# EAGLE design caudalimetro (EAGLE 7.2.0)
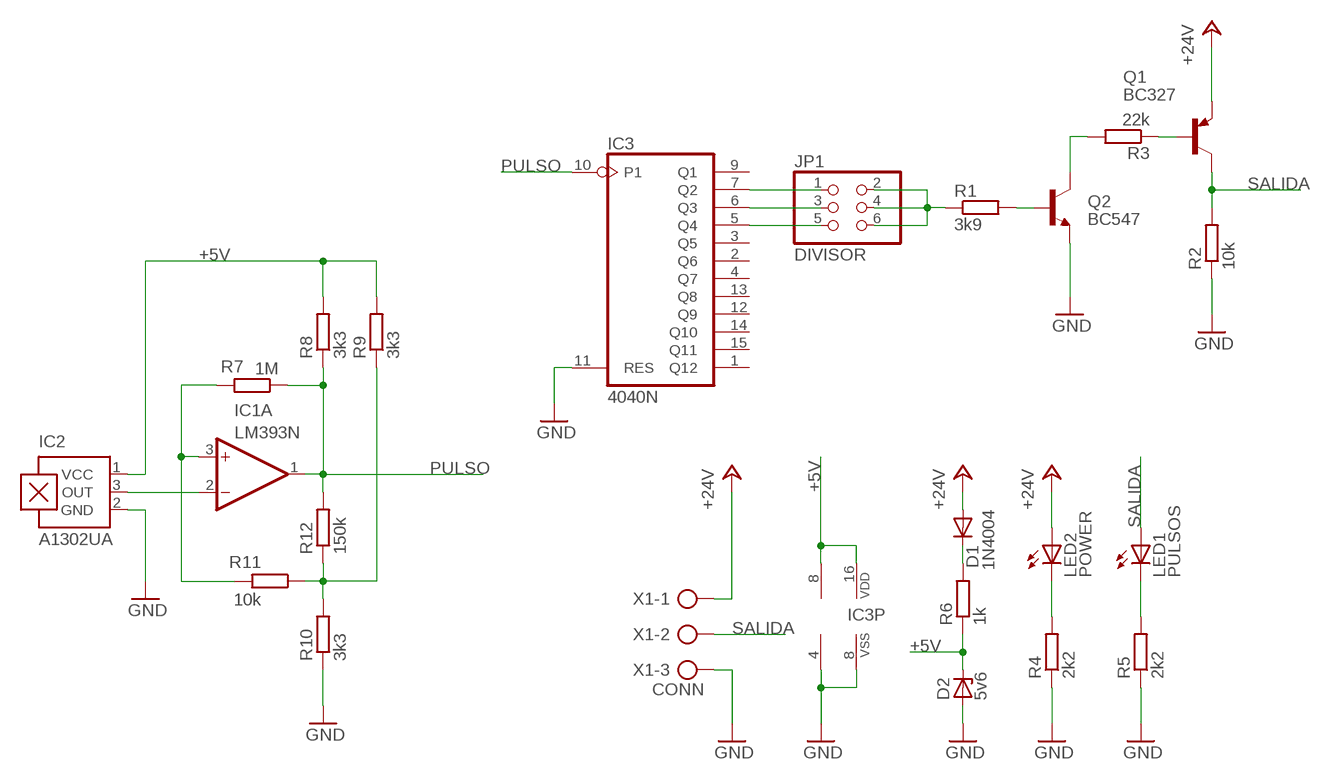
[diagram p0: schematic, sheet 1]

## Parts
D1  1N4004  [DO41-10]
D2  5v6  ZENER-DIODEZD-2.5  [ZDIO-2.5]
IC1  LM393N  [DIL08]
IC2  A1302UA  [SIP3-UA]
IC3  4040N  [DIL16]
JP1  DIVISOR  PINHD-2X3  [2X03]
LED1  PULSOS  LED3MM  [LED3MM]
LED2  POWER  LED3MM  [LED3MM]
Q1  BC327  [TO92]
Q2  BC547  [TO92]
R1  3k9  R-EU_0207/2V  [0207/2V]
R2  10k  R-EU_0207/2V  [0207/2V]
R3  22k  R-EU_0207/2V  [0207/2V]
R4  2k2  R-EU_0207/2V  [0207/2V]
R5  2k2  R-EU_0207/2V  [0207/2V]
R6  1k  R-EU_0207/2V  [0207/2V]
R7  1M  R-EU_0207/2V  [0207/2V]
R8  3k3  R-EU_0207/2V  [0207/2V]
R9  3k3  R-EU_0207/2V  [0207/2V]
R10  3k3  R-EU_0207/2V  [0207/2V]
R11  10k  R-EU_0207/2V  [0207/2V]
R12  150k  R-EU_0207/2V  [0207/2V]
X1  CONN  AK300/3  [AK300/3]

## Nets
+5V: D2.C IC1.8(P:V+) IC2.1(VCC) IC3.16(VDD) R6.1 R8.2 R9.2
+24V: D1.A LED2.A Q1.1(E) X1.1
GND: D2.A IC1.4(P:V-) IC2.2(GND) IC3.8(VSS) IC3.11(RES) Q2.1(E) R2.1 R4.1 R5.1 R10.1 X1.3
N$1: IC3.7(Q2) JP1.1
N$2: IC3.6(Q3) JP1.3
N$3: IC3.5(Q4) JP1.5
N$4: Q2.2(B) R1.2
N$5: Q2.3(C) R3.2
N$6: LED2.K(C) R4.2
N$7: LED1.K(C) R5.2
N$8: IC1.2(A:-IN) IC2.3(OUT)
N$9: D1.C R6.2
N$10: JP1.2 JP1.4 JP1.6 R1.1
N$11: Q1.2(B) R3.1
N$13: R9.1 R10.2 R11.1 R12.1
N$14: IC1.3(A:+IN) R7.2 R11.2
PULSO: IC1.1(A:OUT) IC3.10(P1) R7.1 R8.1 R12.2
SALIDA: LED1.A Q1.3(C) R2.2 X1.2
Unconnected: IC1.5(B:+IN) IC1.6(B:-IN) IC1.7(B:OUT) IC3.1(Q12) IC3.2(Q6) IC3.3(Q5) IC3.4(Q7) IC3.9(Q1) IC3.12(Q9) IC3.13(Q8) IC3.14(Q10) IC3.15(Q11)

## Library data of the parts
D1 = adafruit:1N4004: DIODE General purpose 1N400x type rectifier (With bigger pads) http://www.ladyada.net/library/pcb/eaglelibrary.html
D2 = diode:ZENER-DIODE: Z-Diode
IC1 = linear:LM393: COMPARATOR
IC2 = allegro:A13*?: Linear Hall Effect Sensor ICs Continuous-Time Ratiometric High-Temperature Operation Programmable Linear with Analog Output A1302 -Replacement- UGN3503 Source: http://www.allegromicro.com/en/Products/Part_Numbers/1301/1301.pdf http://www.allegromicro.com/en/Products/Part_Numbers/1321/1321.pdf http://www.allegromicro.com/en/Products/Part_Numbers/1381/1381.pdf; MF: ALLEGRO MICROSYSTEMS, INC.; MPN: A1302EUA-T; OC_FARNELL: 1521708; OC_NEWARK: 31K6639
IC3 = 40xx:4040: 12-stage binary/ripple COUNTER
JP1 = pinhead:PINHD-2X3: PIN HEADER
LED1 LED2 = led:LED: LED OSRAM: - CHIPLED LG R971, LG N971, LY N971, LG Q971, LY Q971, LO R971, LY R971 LH N974, LH R974 LS Q976, LO Q976, LY Q976 LO Q996 - Hyper CHIPLED LW Q18S LB Q993, LB Q99A, LB R99A - SideLED LS A670, LO A670, LY A670, LG A670, LP A670 LB A673, LV A673, LT A673, LW A673 LH A674 LY A675 LS A676, LA A676, LO A676, LY A676, LW A676 LS A679, LY A679, LG A679 - Hyper Micro SIDELED® LS Y876, LA Y876, LO Y876, LY Y876 LT Y87S - SmartLED LW L88C, LW L88S LB L89C, LB L89S, LG L890 LS L89K, LO L89K, LY L89K LS L896, LA L896, LO L896, LY L896 - TOPLED LS T670, LO T670, LY T670, LG T670, LP T670 LSG T670, LSP T670, LSY T670, LOP T670, LYG T670 LG T671, LOG T671, LSG T671 LB T673, LV T673, LT T673, LW T673 LH T674 LS T676, LA T676, LO T676, LY T676, LB T676, LH T676, LSB T676, LW T676 LB T67C, LV T67C, LT T67C, LS T67K, LO T67K, LY T67K, LW E67C LS E67B, LA E67B, LO E67B, LY E67B, LB E67C, LV E67C, LT E67C LW T67C LS T679, LY T679, LG T679 LS T770, LO T770, LY T770, LG T770, LP T770 LB T773, LV T773, LT T773, LW T773 LH T774 LS E675, LA E675, LY E675, LS T675 LS T776, LA T776, LO T776, LY T776, LB T776 LHGB T686 LT T68C, LB T68C - Hyper Mini TOPLED® LB M676 - Mini TOPLED Santana® LG M470 LS M47K, LO M47K, LY M47K Source: http://www.osram.convergy.de LUXEON: - LUMILED® LXK2-PW12-R00, LXK2-PW12-S00, LXK2-PW14-U00, LXK2-PW14-V00 LXK2-PM12-R00, LXK2-PM12-S00, LXK2-PM14-U00 LXK2-PE12-Q00, LXK2-PE12-R00, LXK2-PE12-S00, LXK2-PE14-T00, LXK2-PE14-U00 LXK2-PB12-K00, LXK2-PB12-L00, LXK2-PB12-M00, LXK2-PB14-N00, LXK2-PB14-P00, LXK2-PB14-Q00 LXK2-PR12-L00, LXK2-PR12-M00, LXK2-PR14-Q00, LXK2-PR14-R00 LXK2-PD12-Q00, LXK2-PD12-R00, LXK2-PD12-S00 LXK2-PH12-R00, LXK2-PH12-S00 LXK2-PL12-P00, LXK2-PL12-Q00, LXK2-PL12-R00 Source: www.luxeon.com KINGBRIGHT: KA-3528ASYC Source: www.kingbright.com
Q1 = transistor-pnp:BC327: PNP Transistor
Q2 = transistor:BC547: NPN TRANSISTOR
R1-R12 = rcl:R-EU_: RESISTOR, European symbol
X1 = con-ptr500:AK300/3: CONNECTOR; OC_FARNELL: unknown; OC_NEWARK: unknown

## Board
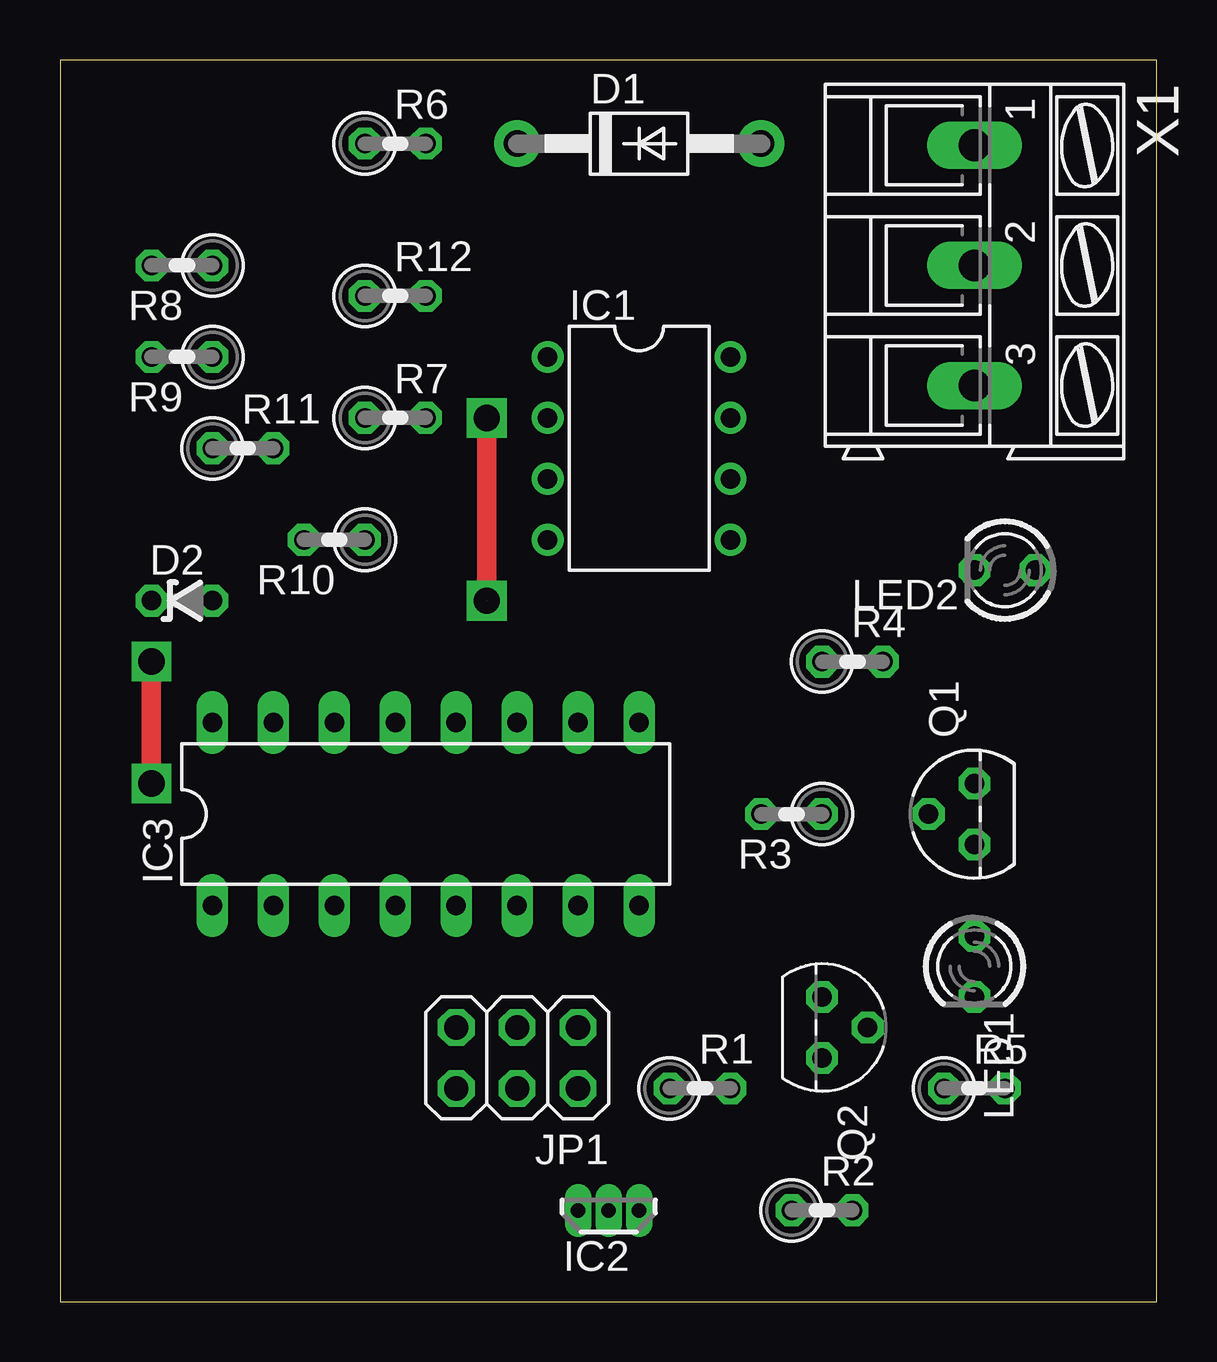
[diagram p1: board, top side]
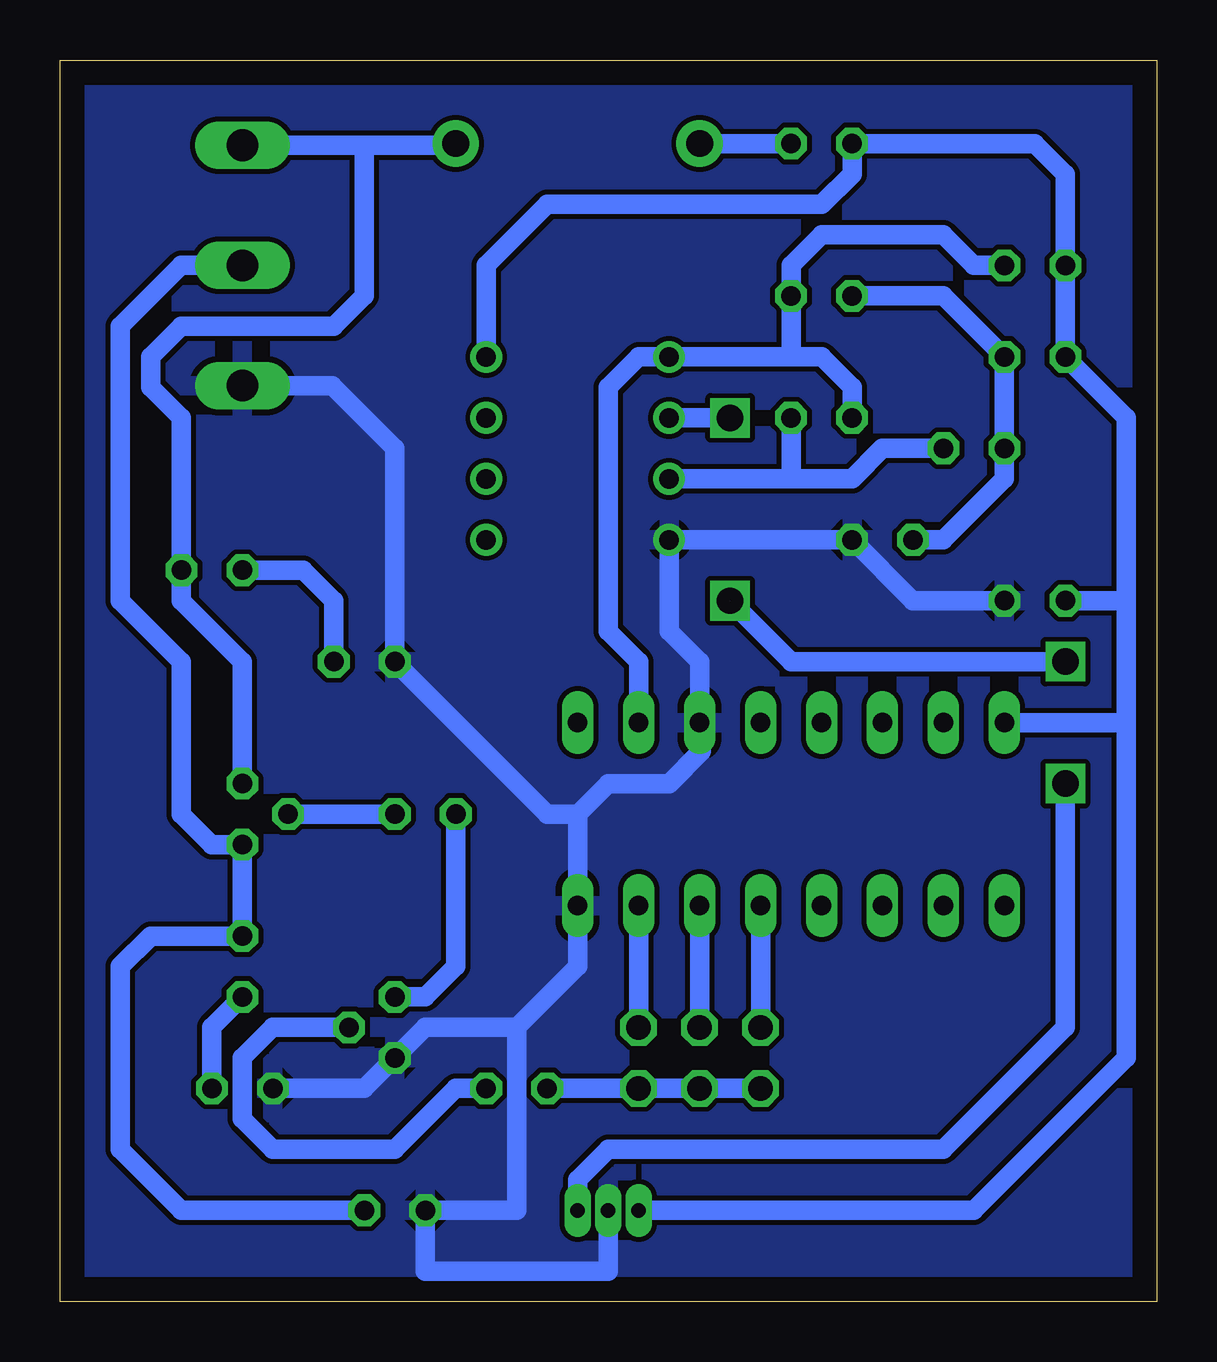
[diagram p2: board, bottom side, seen from below]

Size 45.7 x 51.74 mm. Coordinates in mm from the lower left corner, seen from the top.
Outline: 0,0 45.7,0 45.7,51.74 0,51.74 0,0
Copper layers (1*16): Top 0.035mm / dielectric 1.5mm / Bottom 0.035mm
Design rules "default": minimum track width 10mil, minimum drill 24mil, track to track 8mil, track to pad 8mil, pad to pad 8mil, via to via 8mil, smd to smd 8mil, copper to edge 40mil, drill to drill 8mil, minimum pad ring 10mil, minimum via ring 8mil, stop-mask expansion 4mil, vias tented up to drill 0mil, thermal gap 10mil

### Footprints (pad centres in the part's own frame; a part is rotated, then mirrored left to right if it is on the bottom)
DO41-10 = drill 1.118 pad 1.93: A 5.08,0; C -5.08,0
ZDIO-2.5 = drill 0.813 octagon: A 1.27,0; C -1.27,0
DIL08 = drill 0.813 pad 1.27: 1 -3.81,-3.81; 2 -1.27,-3.81; 3 1.27,-3.81; 4 3.81,-3.81; 5 3.81,3.81; 6 1.27,3.81; 7 -1.27,3.81; 8 -3.81,3.81
SIP3-UA = drill 0.6 pad 0.7 long: 1 -1.27,0; 2 0,0; 3 1.27,0
DIL16 = drill 0.813 long: 1 -8.89,-3.81; 2 -6.35,-3.81; 3 -3.81,-3.81; 4 -1.27,-3.81; 5 1.27,-3.81; 6 3.81,-3.81; 7 6.35,-3.81; 8 8.89,-3.81; 9 8.89,3.81; 10 6.35,3.81; 11 3.81,3.81; 12 1.27,3.81; 13 -1.27,3.81; 14 -3.81,3.81; 15 -6.35,3.81; 16 -8.89,3.81
2X03 = drill 1.016 octagon: 1 -2.54,-1.27; 2 -2.54,1.27; 3 0,-1.27; 4 0,1.27; 5 2.54,-1.27; 6 2.54,1.27
LED3MM = drill 0.813 octagon: A -1.27,0; K 1.27,0
TO92 = drill 0.813 octagon: 1 1.27,0; 2 0,1.905; 3 -1.27,0
0207/2V = drill 0.813 octagon: 1 -1.27,0; 2 1.27,0
AK300/3 = drill 1.321 long: 1 -5.004,0; 2 0,0; 3 5.004,0

### Placement (x,y rotation side)
D1  24.13,48.26 0 top
D2  5.08,29.21 0 top
IC1  24.13,35.56 270 top
IC2  22.86,3.81 0 top
IC3  15.24,20.32 0 top
JP1  19.05,10.16 180 top
LED1  38.1,13.97 270 top
LED2  39.37,30.48 180 top
Q1  38.1,20.32 90 top
Q2  31.75,11.43 270 top
R1  26.67,8.89 0 top
R2  31.75,3.81 0 top
R3  30.48,20.32 180 top
R4  33.02,26.67 0 top
R5  38.1,8.89 0 top
R6  13.97,48.26 0 top
R7  13.97,36.83 0 top
R8  5.08,43.18 180 top
R9  5.08,39.37 180 top
R10  11.43,31.75 180 top
R11  7.62,35.56 0 top
R12  13.97,41.91 0 top
X1  38.1,43.18 270 top

### Tracks (layer width: path | path; a pad name or v marks a point on that pad's centre or on a via)
+5V
  Bottom 0.813: IC1.8 27.94,43.18 25.4,45.72 13.97,45.72 12.7,46.99 R6.1 5.08,48.26 3.81,46.99 R8.2 R9.2 1.27,36.83 1.27,29.21 | 1.27,24.13 1.27,10.16 7.62,3.81 IC2.1 | 1.27,24.13 1.27,29.21 | D2.C 1.27,29.21 | IC3.16 1.27,24.13
+24V
  Bottom 0.813: X1.1 33.02,48.18 | 33.02,48.18 29.29,48.18 D1.A | Q1.1 38.1,26.67 40.64,29.21 LED2.A 40.64,36.83 41.91,38.1 41.91,39.37 40.64,40.64 34.29,40.64 33.02,41.91 33.02,48.18
GND
  Bottom 0.254: 24,16.66 IC3.8 | 18.97,23.98 IC3.11
  Bottom 0.813: X1.3 34.37,38.18 31.75,35.56 R4.1 25.4,20.32 24.13,20.32 | 18.97,23.98 18.97,22.94 20.32,21.59 22.86,21.59 24.13,20.32 | 24.13,20.32 IC3.8 24.13,13.97 26.67,11.43 | 26.67,11.43 30.48,11.43 Q2.1 33.02,8.89 R5.1 | D2.A 10.16,29.21 R10.1 IC1.4 20.32,27.94 19.05,26.67 IC3.11 | IC2.2 22.86,1.27 30.48,1.27 R2.1 26.67,3.81 26.67,11.43
  pour Bottom: 0,52.07 45.72,52.07 45.72,0 0,0
N$1
  Bottom 0.813: JP1.1 IC3.7
N$2
  Bottom 0.813: JP1.3 IC3.6
N$3
  Bottom 0.813: JP1.5 IC3.5
N$4
  Bottom 0.813: R1.2 29.21,8.89 31.75,6.35 36.83,6.35 38.1,7.62 38.1,10.16 36.83,11.43 Q2.2
N$5
  Bottom 0.813: Q2.3 30.48,12.7 29.21,13.97 R3.2
N$6
  Bottom 0.813: LED2.K 35.56,30.48 34.29,29.21 R4.2
N$7
  Bottom 0.813: LED1.K 39.37,11.43 R5.2
N$8  (via drill 1.1)  (1 unrouted)
  Top 0.813: v17.78,36.83 17.78,29.21 | v3.81,21.59 v3.81,26.67
  Bottom 0.813: IC1.2 v17.78,36.83 | v3.81,21.59 3.81,11.43 8.89,6.35 22.86,6.35 24.13,5.08 IC2.3 | v3.81,26.67 15.24,26.67 17.78,29.21
N$9
  Bottom 0.813: D1.C R6.2
N$10
  Bottom 0.813: JP1.6 JP1.4 JP1.2 R1.1
N$11
  Bottom 0.813: R3.1 Q1.2
N$12  (via drill 1.1)
  other vias: 17.78,29.21
N$13
  Bottom 0.813: R12.1 8.89,41.91 R9.1 R11.1 6.35,34.29 8.89,31.75 R10.2
N$14
  Bottom 0.813: R11.2 11.43,35.56 12.7,34.29 15.24,34.29 | 15.24,34.29 IC1.3 | R7.2 15.24,34.29
N$15  (via drill 1.1)
  other vias: 3.81,21.59
N$16  (via drill 1.1)
  other vias: 3.81,26.67
PULSO
  Bottom 0.813: 15.24,39.37 IC1.1 21.59,39.37 22.86,38.1 22.86,27.94 21.59,26.67 IC3.10 | R8.1 7.62,43.18 8.89,44.45 13.97,44.45 15.24,43.18 R12.2 15.24,39.37 | 15.24,39.37 13.97,39.37 12.7,38.1 R7.1
SALIDA
  Bottom 0.813: X1.2 40.64,43.18 43.18,40.64 43.18,29.21 40.64,26.67 40.64,20.32 39.37,19.05 Q1.3 LED1.A 41.91,15.24 43.18,13.97 43.18,6.35 40.64,3.81 R2.2